# Altium schematic sheet op_amp.SchDoc: Analog Front End
size A; DrawnBy: Santiago Navonne; Engineer: Santiago Navonne; Revision: 1.0; SheetNumber: 1; SheetTotal: 1
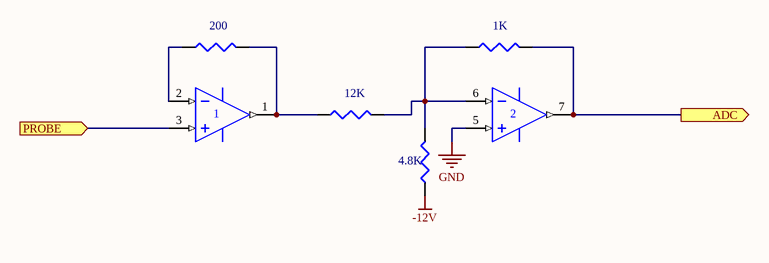
[diagram p0: op_amp.SchDoc]

## Parts
(Parts that share a designator on the sheet are numbered #1, #2 ... from top to bottom, then left to right.)
R?#1  value 200  [J1-0603]  (hidden comment: Res3)
R?#2  value 1K  [J1-0603]  (hidden comment: Res3)
R?#3  value 12K  [J1-0603]  (hidden comment: Res3)
R?#4  value 4.8K  [J1-0603]  (hidden comment: Res3)
U?#1  LM258D  [D008_L]  (value not drawn)  (part A of 2)
U?#2  LM258D  [D008_L]  (value not drawn)  (part B of 2)

## Ports
ADC (out), PROBE (in)

## Nets
-12V: R?#4.1
GND: U?#2.5(IN+)
ADC: R?#2.2 U?#2.7(OUT) ; port ADC
PROBE: U?#1.3(IN+) ; port PROBE
NetR?#1_1: R?#1.1 U?#1.2(IN-)
NetR?#1_2: R?#1.2 R?#3.1 U?#1.1(OUT)
NetR?#2_1: R?#2.1 R?#3.2 R?#4.2 U?#2.6(IN-)

Not connected (* = marked no-connect by the designer): U?#1 4(V-) 8(V+); U?#2 4(V-) 8(V+)

## Library data of the parts
R?#1-R?#4 = Res3: Resistor; Published: 8-Jun-2000; LatestRevisionDate: 29-May-2009; LatestRevisionNote: IPC-7351 Footprint Added.; PackageReference: J1-0603; Publisher: Altium Limited; PackageDescription: Chip Resistor
U?#1 U?#2 = LM258D: Dual Operational Amplifier; Published: 15-Apr-2002; LatestRevisionDate: 13-Apr-2006; LatestRevisionNote: IPC-7351 Footprint Added.; DatasheetVersion: Aug-1988; PackageVersion: Jan-1998; PackageReference: D008; Publisher: Altium Limited; PackageDescription: 8-Pin Small Outline Integrated Circuit 1.27 mm Pitch; Code_IPC: SOIC127P600-8; ComponentLink1Description: Manufacturer Link; ComponentLink1URL: http://www.ti.com/; ComponentLink2Description: Datasheet; ComponentLink2URL: http://www-s.ti.com/sc/ds/lm258.pdf